# Altium schematic sheet TopShem.SchDoc: Наименование
size 420 x 297 mm; ApprovedBy: Сидоров; CheckedBy: Петров; Author: Иванов; CompanyName: РГППУ; Title2str: Изделия; DecimalNumber: АБВГ.123456.001 33
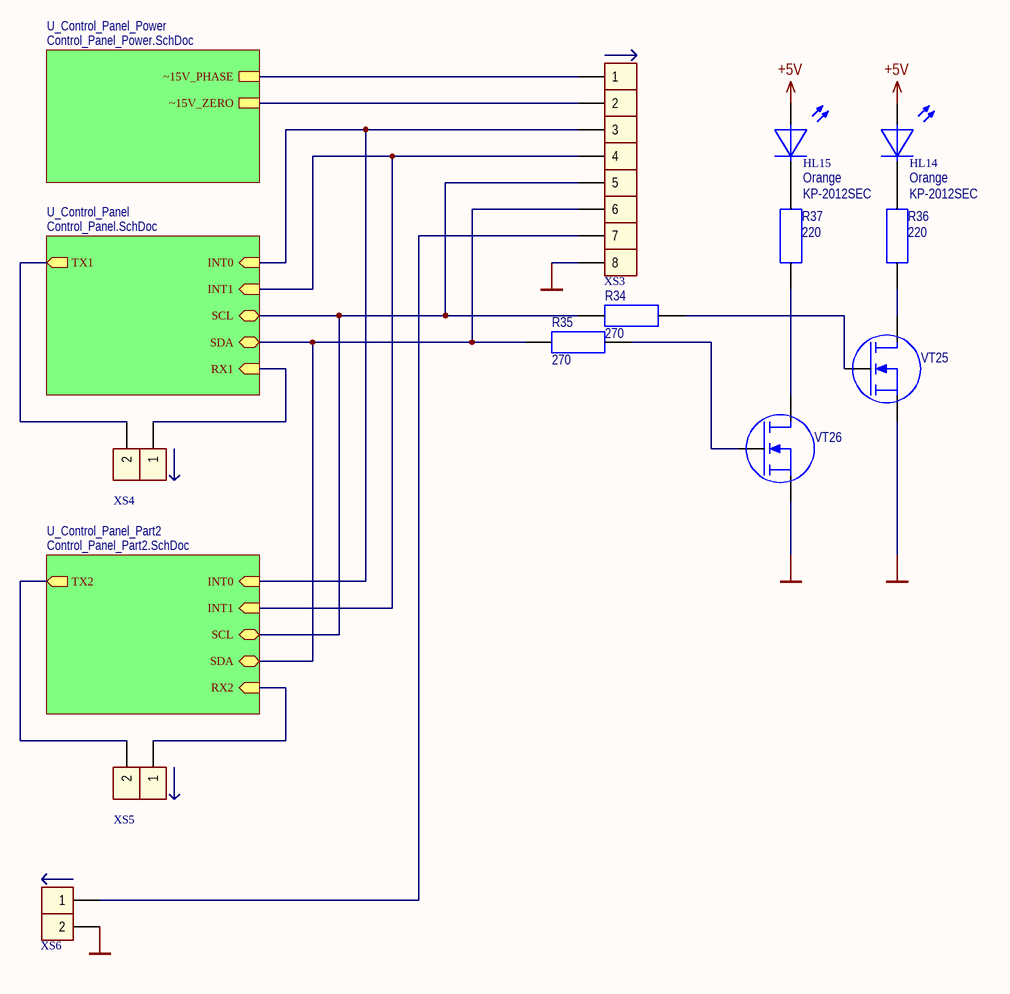
[diagram p0: TopShem.SchDoc]

## Parts
HL14  Orange  ManufacturerPartNumber: KP-2012SEC  [DIOMELF2012M]
HL15  Orange  ManufacturerPartNumber: KP-2012SEC  [DIOMELF2012M]
R34  270  [SMDRC0805]
R35  270  [SMDRC0805]
R36  220  [SMDRC0805]
R37  220  [SMDRC0805]
VT25  2N7002  [SOT23 (TO-236AB)]  (value not drawn)
VT26  2N7002  [SOT23 (TO-236AB)]  (value not drawn)
XS3  PLS-08R  [PLS-08R2]  (value not drawn)
XS4  PLS-02  [PLS-02]  (value not drawn)
XS5  PLS-02  [PLS-02]  (value not drawn)
XS6  PLS-02R  [PLS-02R1]  (value not drawn)

## Sub-sheets
U_Control_Panel = Control_Panel.SchDoc: INT0 (in), INT1 (in), SCL (bidir), SDA (bidir), RX1 (in), TX1 (out)
U_Control_Panel_Part2 = Control_Panel_Part2.SchDoc: INT0 (in), INT1 (in), SCL (bidir), SDA (bidir), RX2 (in), TX2 (out)
U_Control_Panel_Power = Control_Panel_Power.SchDoc: ~15V_PHASE, ~15V_ZERO

## Nets
+5V: HL14.1 HL15.1
GND: VT25.2(S) VT26.2(S) XS3.8 XS6.2
NetHL14_2: HL14.2 R36.2
NetHL15_2: HL15.2 R37.2
NetR34_1: R34.1 VT25.1(G)
NetR34_2: R34.2 XS3.5 ; sheet U_Control_Panel/SCL, sheet U_Control_Panel_Part2/SCL
NetR35_1: R35.1 VT26.1(G)
NetR35_2: R35.2 XS3.6 ; sheet U_Control_Panel/SDA, sheet U_Control_Panel_Part2/SDA
NetR36_1: R36.1 VT25.3(D)
NetR37_1: R37.1 VT26.3(D)
NetXS3_1: XS3.1 ; sheet U_Control_Panel_Power/~15V_PHASE
NetXS3_2: XS3.2 ; sheet U_Control_Panel_Power/~15V_ZERO
NetXS3_3: XS3.3 ; sheet U_Control_Panel/INT0, sheet U_Control_Panel_Part2/INT0
NetXS3_4: XS3.4 ; sheet U_Control_Panel/INT1, sheet U_Control_Panel_Part2/INT1
NetXS3_7: XS3.7 XS6.1
NetXS4_1: XS4.1 ; sheet U_Control_Panel/RX1
NetXS4_2: XS4.2 ; sheet U_Control_Panel/TX1
NetXS5_1: XS5.1 ; sheet U_Control_Panel_Part2/RX2
NetXS5_2: XS5.2 ; sheet U_Control_Panel_Part2/TX2

## Notes on the sheet
- Изм.
- Лист
- N*докум.
- Подп.
- Дата
- Лит.
- Масса
- Масштаб
- Разраб.
- Пров.
- Т.контр.
- Лиcт
- Лиcтов
- Н.контр.
- Утв.

## Library data of the parts
HL14 HL15 = LED1_O: Diod LED SMD Orange; ComponentLink1Description: Datasheet; Cost: 4,91; ComponentLink2Description: Datasheet-local; ComponentLink2URL: *; Color: Orange
R34 R35 = Resistor 0805 270: Generic resistor; PartNumber: Resistor 0805 270; Value: 270; ComponentLink1URL: http://www.mouser.com/ds/2/447/PYu-RC0402_51_RoHS_L_6_r-8721.pdf; ComponentLink1Description: Datasheet; Package: 0805
R36 R37 = Resistor 0805 220: Generic resistor; PartNumber: Resistor 0805 220; Value: 220; ComponentLink1URL: http://www.mouser.com/ds/2/447/PYu-RC0402_51_RoHS_L_6_r-8721.pdf; ComponentLink1Description: Datasheet; Package: 0805
VT25 VT26 = 2N7002 n-MOSFET: 60V, 300mA N-channel Trench MOSFET; ManufacturerPartNumber: 2N7002
XS3 = Con8_M PLS-08MR: Male 8-pin connection; ManufacturerPartNumber: PLS-08R; ComponentLink1Description: Datasheet; ComponentLink1URL: http://www.promelec.ru/catalog/406/1218/1223/1/99528/; ComponentLink2Description: Datasheet-local; ComponentLink2URL: *
XS4 XS5 = Con2_M_PLS-02: Male 2-pin connection; ManufacturerPartNumber: PLS-02; ComponentLink1Description: Datasheet; ComponentLink1URL: http://www.promelec.ru/catalog/406/1218/1224/1/24233/; ComponentLink2Description: Datasheet-local; ComponentLink2URL: *
XS6 = Con2_M_PLS-02R: Male 2-pin connection; ManufacturerPartNumber: PLS-02R; ComponentLink1Description: Datasheet; ComponentLink1URL: http://www.promelec.ru/catalog/406/1218/1224/1/24233/; ComponentLink2Description: Datasheet-local; ComponentLink2URL: *